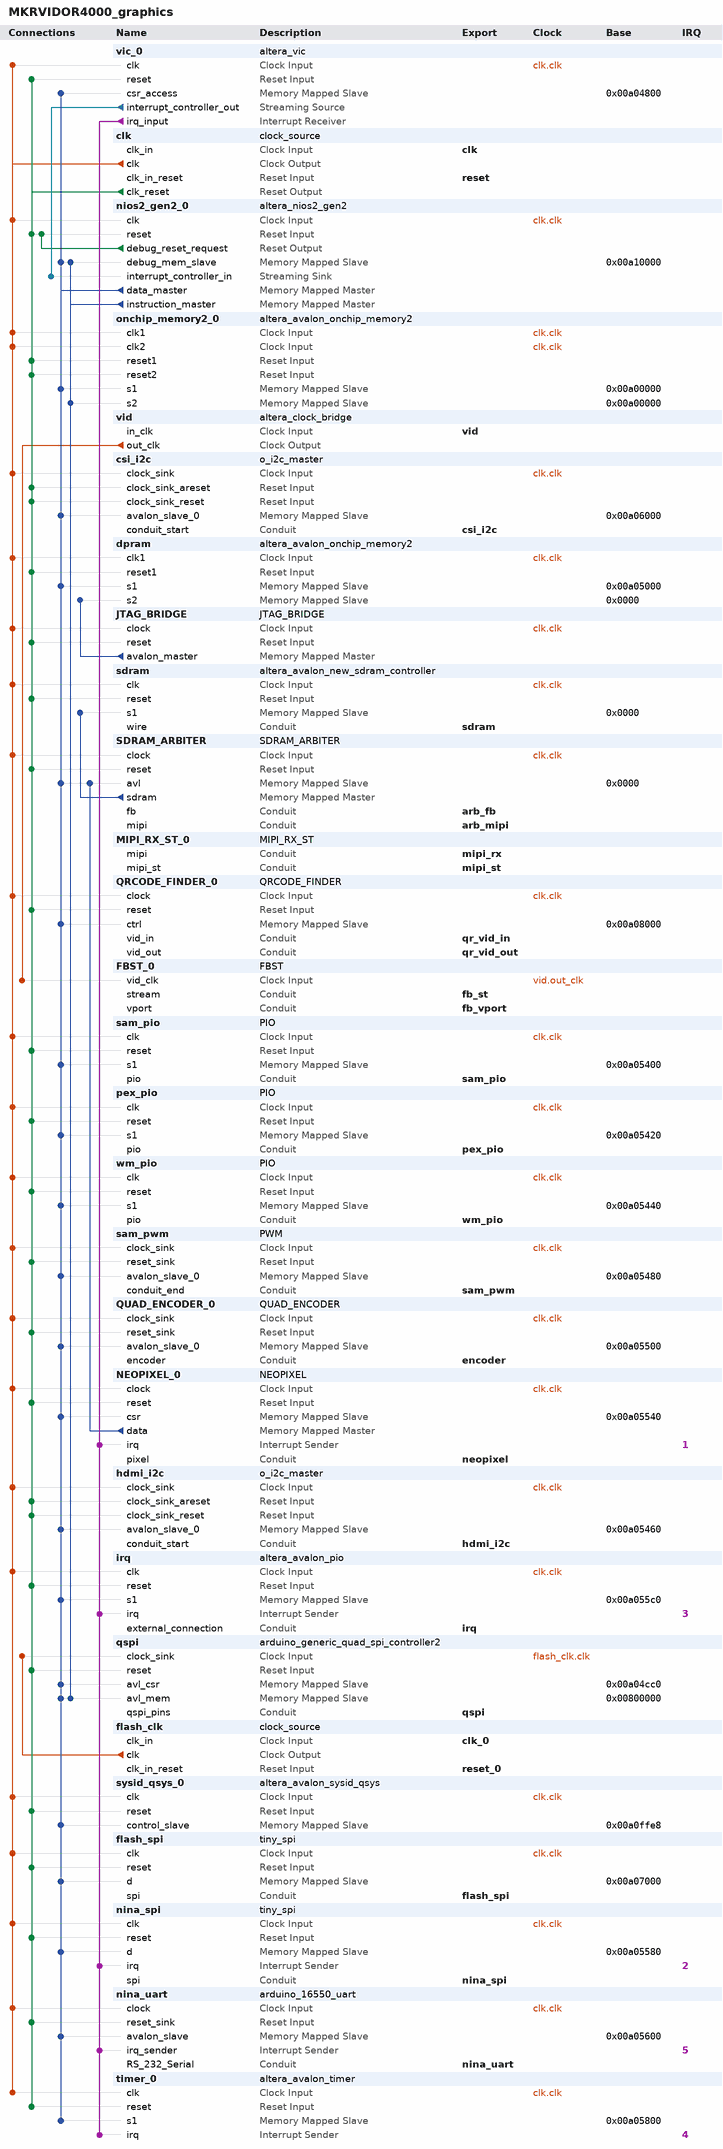
[diagram p0: system contents]
# Platform Designer (Qsys) system MKRVIDOR4000_graphics, Cyclone 10 LP 10CL016YU256C8G
# Parameters at their usual value, and those the tool derives, are not listed.
package require -exact qsys 18.0
create_system MKRVIDOR4000_graphics
set_project_property DEVICE_FAMILY {Cyclone 10 LP}
set_project_property DEVICE 10CL016YU256C8G

add_instance vic_0 altera_vic 18.0
set_instance_parameter_value vic_0 DAISY_CHAIN_ENABLE 0
set_instance_parameter_value vic_0 INTERRUPT_LATENCY_CYCLES 2
set_instance_parameter_value vic_0 NUMBER_OF_INT_PORTS 8
set_instance_parameter_value vic_0 OVERRIDE_INTERRUPT_LATENCY false
set_instance_parameter_value vic_0 RIL_WIDTH 4

add_instance clk clock_source 18.0
set_instance_parameter_value clk clockFrequency 100000000

add_instance nios2_gen2_0 altera_nios2_gen2 18.0
set_instance_parameter_value nios2_gen2_0 cpuID 531
set_instance_parameter_value nios2_gen2_0 dcache_size 2048
set_instance_parameter_value nios2_gen2_0 debug_hwbreakpoint 4
set_instance_parameter_value nios2_gen2_0 exceptionSlave onchip_memory2_0.s2
set_instance_parameter_value nios2_gen2_0 icache_size 8192
set_instance_parameter_value nios2_gen2_0 impl Fast
set_instance_parameter_value nios2_gen2_0 io_regionbase 10485760
set_instance_parameter_value nios2_gen2_0 resetSlave onchip_memory2_0.s2
set_instance_parameter_value nios2_gen2_0 setting_interruptControllerType External
set_instance_parameter_value nios2_gen2_0 setting_shadowRegisterSets 1

add_instance onchip_memory2_0 altera_avalon_onchip_memory2 18.0
set_instance_parameter_value onchip_memory2_0 dataWidth 32
set_instance_parameter_value onchip_memory2_0 dualPort true
set_instance_parameter_value onchip_memory2_0 initMemContent true
set_instance_parameter_value onchip_memory2_0 initializationFileName onchip_mem.hex
set_instance_parameter_value onchip_memory2_0 memorySize 16384

add_instance vid altera_clock_bridge 18.0
set_instance_parameter_value vid DERIVED_CLOCK_RATE 0
set_instance_parameter_value vid EXPLICIT_CLOCK_RATE 0

add_instance csi_i2c o_i2c_master 1.0

add_instance dpram altera_avalon_onchip_memory2 18.0
set_instance_parameter_value dpram dataWidth 32
set_instance_parameter_value dpram dualPort true
set_instance_parameter_value dpram initMemContent true
set_instance_parameter_value dpram initializationFileName onchip_mem.hex
set_instance_parameter_value dpram memorySize 1024
set_instance_parameter_value dpram singleClockOperation true

add_instance JTAG_BRIDGE JTAG_BRIDGE 1.0

add_instance sdram altera_avalon_new_sdram_controller 18.0
set_instance_parameter_value sdram TAC 5.4
set_instance_parameter_value sdram TRCD 20.0
set_instance_parameter_value sdram TRP 20.0
set_instance_parameter_value sdram casLatency 2
set_instance_parameter_value sdram columnWidth 8
set_instance_parameter_value sdram dataWidth 16
set_instance_parameter_value sdram generateSimulationModel false
set_instance_parameter_value sdram model single_Micron_MT48LC4M32B2_7_chip
set_instance_parameter_value sdram numberOfBanks 4
set_instance_parameter_value sdram numberOfChipSelects 1
set_instance_parameter_value sdram powerUpDelay 200.0
set_instance_parameter_value sdram refreshPeriod 31.25
set_instance_parameter_value sdram rowWidth 12

add_instance SDRAM_ARBITER SDRAM_ARBITER 1.0
set_instance_parameter_value SDRAM_ARBITER pADDRESS_BITS 22
set_instance_parameter_value SDRAM_ARBITER pBURST_SIZE 128
set_instance_parameter_value SDRAM_ARBITER pCAM_OFFSET_A 0
set_instance_parameter_value SDRAM_ARBITER pCAM_OFFSET_B 307200
set_instance_parameter_value SDRAM_ARBITER pFB_OFFSET 614400
set_instance_parameter_value SDRAM_ARBITER pFB_SIZE 307200

add_instance MIPI_RX_ST_0 MIPI_RX_ST 1.0

add_instance QRCODE_FINDER_0 QRCODE_FINDER 1.0
set_instance_parameter_value QRCODE_FINDER_0 pFIXED 5
set_instance_parameter_value QRCODE_FINDER_0 pHRES 640
set_instance_parameter_value QRCODE_FINDER_0 pTHRESHOLD 60
set_instance_parameter_value QRCODE_FINDER_0 pTHRESH_MIN 4
set_instance_parameter_value QRCODE_FINDER_0 pVRES 480

add_instance FBST_0 FBST 1.0
set_instance_parameter_value FBST_0 pHRES 640
set_instance_parameter_value FBST_0 pHSE 752
set_instance_parameter_value FBST_0 pHSS 656
set_instance_parameter_value FBST_0 pHTOTAL 762
set_instance_parameter_value FBST_0 pVRES 480
set_instance_parameter_value FBST_0 pVSE 492
set_instance_parameter_value FBST_0 pVSS 490
set_instance_parameter_value FBST_0 pVTOTAL 525

add_instance sam_pio PIO 1.0

add_instance pex_pio PIO 1.0

add_instance wm_pio PIO 1.0

add_instance sam_pwm PWM 1.0
set_instance_parameter_value sam_pwm pCHANNELS 23
set_instance_parameter_value sam_pwm pMATCH_BITS 16
set_instance_parameter_value sam_pwm pPRESCALER_BITS 32

add_instance QUAD_ENCODER_0 QUAD_ENCODER 1.0
set_instance_parameter_value QUAD_ENCODER_0 pENCODERS 11
set_instance_parameter_value QUAD_ENCODER_0 pENCODER_PRECISION 32

add_instance NEOPIXEL_0 NEOPIXEL 1.0
set_instance_parameter_value NEOPIXEL_0 pCHANNELS 11
set_instance_parameter_value NEOPIXEL_0 pSTART_ADDRESS 2097152

add_instance hdmi_i2c o_i2c_master 1.0

add_instance irq altera_avalon_pio 18.0
set_instance_parameter_value irq captureEdge true
set_instance_parameter_value irq direction InOut
set_instance_parameter_value irq generateIRQ true
set_instance_parameter_value irq irqType EDGE
set_instance_parameter_value irq width 2

add_instance qspi arduino_generic_quad_spi_controller2 18.0
set_instance_parameter_value qspi ATOM UNIDIRECTIONAL
set_instance_parameter_value qspi CHIP_SELS 1
set_instance_parameter_value qspi FLASH_TYPE N25Q16
set_instance_parameter_value qspi IO_MODE QUAD
set_instance_parameter_value qspi clkFreq 40000000

add_instance flash_clk clock_source 18.0
set_instance_parameter_value flash_clk clockFrequency 40000000

add_instance sysid_qsys_0 altera_avalon_sysid_qsys 18.0
set_instance_parameter_value sysid_qsys_0 id -1161707801

add_instance flash_spi tiny_spi 1.0
set_instance_parameter_value flash_spi BAUD_DIV 0
set_instance_parameter_value flash_spi BAUD_WIDTH 8
set_instance_parameter_value flash_spi SPI_MODE 0

add_instance nina_spi tiny_spi 1.0
set_instance_parameter_value nina_spi BAUD_DIV 0
set_instance_parameter_value nina_spi BAUD_WIDTH 8
set_instance_parameter_value nina_spi SPI_MODE 0

add_instance nina_uart arduino_16550_uart 18.0
set_instance_parameter_value nina_uart DMA_EXTRA 0
set_instance_parameter_value nina_uart FAMILY {Cyclone 10 LP}
set_instance_parameter_value nina_uart FIFO_DEPTH 128
set_instance_parameter_value nina_uart FIFO_HWFC 0
set_instance_parameter_value nina_uart FIFO_MODE 0
set_instance_parameter_value nina_uart FIFO_SWFC 0
set_instance_parameter_value nina_uart FIFO_WATERMARK 0
set_instance_parameter_value nina_uart MEM_BLOCK_TYPE AUTO

add_instance timer_0 altera_avalon_timer 18.0
set_instance_parameter_value timer_0 period 1
set_instance_parameter_value timer_0 periodUnits MSEC

# connections
add_connection clk.clk csi_i2c.clock_sink clock
add_connection clk.clk dpram.clk1 clock
add_connection clk.clk flash_spi.clk clock
add_connection clk.clk hdmi_i2c.clock_sink clock
add_connection clk.clk irq.clk clock
add_connection clk.clk JTAG_BRIDGE.clock clock
add_connection clk.clk NEOPIXEL_0.clock clock
add_connection clk.clk nina_spi.clk clock
add_connection clk.clk nina_uart.clock clock
add_connection clk.clk nios2_gen2_0.clk clock
add_connection clk.clk onchip_memory2_0.clk1 clock
add_connection clk.clk onchip_memory2_0.clk2 clock
add_connection clk.clk pex_pio.clk clock
add_connection clk.clk QRCODE_FINDER_0.clock clock
add_connection clk.clk QUAD_ENCODER_0.clock_sink clock
add_connection clk.clk sam_pio.clk clock
add_connection clk.clk sam_pwm.clock_sink clock
add_connection clk.clk sdram.clk clock
add_connection clk.clk SDRAM_ARBITER.clock clock
add_connection clk.clk sysid_qsys_0.clk clock
add_connection clk.clk timer_0.clk clock
add_connection clk.clk vic_0.clk clock
add_connection clk.clk wm_pio.clk clock
add_connection flash_clk.clk qspi.clock_sink clock
add_connection vid.out_clk FBST_0.vid_clk clock
add_connection clk.clk_reset csi_i2c.clock_sink_areset reset
add_connection clk.clk_reset csi_i2c.clock_sink_reset reset
add_connection clk.clk_reset dpram.reset1 reset
add_connection clk.clk_reset flash_spi.reset reset
add_connection clk.clk_reset hdmi_i2c.clock_sink_areset reset
add_connection clk.clk_reset hdmi_i2c.clock_sink_reset reset
add_connection clk.clk_reset irq.reset reset
add_connection clk.clk_reset JTAG_BRIDGE.reset reset
add_connection clk.clk_reset NEOPIXEL_0.reset reset
add_connection clk.clk_reset nina_spi.reset reset
add_connection clk.clk_reset nina_uart.reset_sink reset
add_connection clk.clk_reset nios2_gen2_0.reset reset
add_connection clk.clk_reset onchip_memory2_0.reset1 reset
add_connection clk.clk_reset onchip_memory2_0.reset2 reset
add_connection clk.clk_reset pex_pio.reset reset
add_connection clk.clk_reset QRCODE_FINDER_0.reset reset
add_connection clk.clk_reset qspi.reset reset
add_connection clk.clk_reset QUAD_ENCODER_0.reset_sink reset
add_connection clk.clk_reset sam_pio.reset reset
add_connection clk.clk_reset sam_pwm.reset_sink reset
add_connection clk.clk_reset sdram.reset reset
add_connection clk.clk_reset SDRAM_ARBITER.reset reset
add_connection clk.clk_reset sysid_qsys_0.reset reset
add_connection clk.clk_reset timer_0.reset reset
add_connection clk.clk_reset vic_0.reset reset
add_connection clk.clk_reset wm_pio.reset reset
add_connection nios2_gen2_0.debug_reset_request nios2_gen2_0.reset reset
add_connection JTAG_BRIDGE.avalon_master dpram.s2 avalon
set_connection_parameter_value JTAG_BRIDGE.avalon_master/dpram.s2 baseAddress 0x0000
add_connection NEOPIXEL_0.data SDRAM_ARBITER.avl avalon
set_connection_parameter_value NEOPIXEL_0.data/SDRAM_ARBITER.avl baseAddress 0x0000
add_connection nios2_gen2_0.data_master csi_i2c.avalon_slave_0 avalon
set_connection_parameter_value nios2_gen2_0.data_master/csi_i2c.avalon_slave_0 baseAddress 0x00a06000
add_connection nios2_gen2_0.data_master dpram.s1 avalon
set_connection_parameter_value nios2_gen2_0.data_master/dpram.s1 baseAddress 0x00a05000
add_connection nios2_gen2_0.data_master flash_spi.d avalon
set_connection_parameter_value nios2_gen2_0.data_master/flash_spi.d baseAddress 0x00a07000
add_connection nios2_gen2_0.data_master hdmi_i2c.avalon_slave_0 avalon
set_connection_parameter_value nios2_gen2_0.data_master/hdmi_i2c.avalon_slave_0 baseAddress 0x00a05460
add_connection nios2_gen2_0.data_master irq.s1 avalon
set_connection_parameter_value nios2_gen2_0.data_master/irq.s1 baseAddress 0x00a055c0
add_connection nios2_gen2_0.data_master NEOPIXEL_0.csr avalon
set_connection_parameter_value nios2_gen2_0.data_master/NEOPIXEL_0.csr baseAddress 0x00a05540
add_connection nios2_gen2_0.data_master nina_spi.d avalon
set_connection_parameter_value nios2_gen2_0.data_master/nina_spi.d baseAddress 0x00a05580
add_connection nios2_gen2_0.data_master nina_uart.avalon_slave avalon
set_connection_parameter_value nios2_gen2_0.data_master/nina_uart.avalon_slave baseAddress 0x00a05600
add_connection nios2_gen2_0.data_master nios2_gen2_0.debug_mem_slave avalon
set_connection_parameter_value nios2_gen2_0.data_master/nios2_gen2_0.debug_mem_slave baseAddress 0x00a10000
add_connection nios2_gen2_0.data_master onchip_memory2_0.s1 avalon
set_connection_parameter_value nios2_gen2_0.data_master/onchip_memory2_0.s1 baseAddress 0x00a00000
add_connection nios2_gen2_0.data_master pex_pio.s1 avalon
set_connection_parameter_value nios2_gen2_0.data_master/pex_pio.s1 baseAddress 0x00a05420
add_connection nios2_gen2_0.data_master QRCODE_FINDER_0.ctrl avalon
set_connection_parameter_value nios2_gen2_0.data_master/QRCODE_FINDER_0.ctrl baseAddress 0x00a08000
add_connection nios2_gen2_0.data_master qspi.avl_csr avalon
set_connection_parameter_value nios2_gen2_0.data_master/qspi.avl_csr baseAddress 0x00a04cc0
add_connection nios2_gen2_0.data_master qspi.avl_mem avalon
set_connection_parameter_value nios2_gen2_0.data_master/qspi.avl_mem baseAddress 0x00800000
add_connection nios2_gen2_0.data_master QUAD_ENCODER_0.avalon_slave_0 avalon
set_connection_parameter_value nios2_gen2_0.data_master/QUAD_ENCODER_0.avalon_slave_0 baseAddress 0x00a05500
add_connection nios2_gen2_0.data_master sam_pio.s1 avalon
set_connection_parameter_value nios2_gen2_0.data_master/sam_pio.s1 baseAddress 0x00a05400
add_connection nios2_gen2_0.data_master sam_pwm.avalon_slave_0 avalon
set_connection_parameter_value nios2_gen2_0.data_master/sam_pwm.avalon_slave_0 baseAddress 0x00a05480
add_connection nios2_gen2_0.data_master SDRAM_ARBITER.avl avalon
set_connection_parameter_value nios2_gen2_0.data_master/SDRAM_ARBITER.avl baseAddress 0x0000
add_connection nios2_gen2_0.data_master sysid_qsys_0.control_slave avalon
set_connection_parameter_value nios2_gen2_0.data_master/sysid_qsys_0.control_slave baseAddress 0x00a0ffe8
add_connection nios2_gen2_0.data_master timer_0.s1 avalon
set_connection_parameter_value nios2_gen2_0.data_master/timer_0.s1 baseAddress 0x00a05800
add_connection nios2_gen2_0.data_master vic_0.csr_access avalon
set_connection_parameter_value nios2_gen2_0.data_master/vic_0.csr_access baseAddress 0x00a04800
add_connection nios2_gen2_0.data_master wm_pio.s1 avalon
set_connection_parameter_value nios2_gen2_0.data_master/wm_pio.s1 baseAddress 0x00a05440
add_connection nios2_gen2_0.instruction_master nios2_gen2_0.debug_mem_slave avalon
set_connection_parameter_value nios2_gen2_0.instruction_master/nios2_gen2_0.debug_mem_slave baseAddress 0x00a10000
add_connection nios2_gen2_0.instruction_master onchip_memory2_0.s2 avalon
set_connection_parameter_value nios2_gen2_0.instruction_master/onchip_memory2_0.s2 baseAddress 0x00a00000
add_connection nios2_gen2_0.instruction_master qspi.avl_mem avalon
set_connection_parameter_value nios2_gen2_0.instruction_master/qspi.avl_mem baseAddress 0x00800000
add_connection SDRAM_ARBITER.sdram sdram.s1 avalon
set_connection_parameter_value SDRAM_ARBITER.sdram/sdram.s1 arbitrationPriority 8
set_connection_parameter_value SDRAM_ARBITER.sdram/sdram.s1 baseAddress 0x0000
add_connection vic_0.interrupt_controller_out nios2_gen2_0.interrupt_controller_in avalon_streaming
add_connection vic_0.irq_input irq.irq interrupt
set_connection_parameter_value vic_0.irq_input/irq.irq irqNumber 3
add_connection vic_0.irq_input NEOPIXEL_0.irq interrupt
set_connection_parameter_value vic_0.irq_input/NEOPIXEL_0.irq irqNumber 1
add_connection vic_0.irq_input nina_spi.irq interrupt
set_connection_parameter_value vic_0.irq_input/nina_spi.irq irqNumber 2
add_connection vic_0.irq_input nina_uart.irq_sender interrupt
set_connection_parameter_value vic_0.irq_input/nina_uart.irq_sender irqNumber 5
add_connection vic_0.irq_input timer_0.irq interrupt
set_connection_parameter_value vic_0.irq_input/timer_0.irq irqNumber 4

# exported interfaces
add_interface arb_fb conduit end
set_interface_property arb_fb EXPORT_OF SDRAM_ARBITER.fb
add_interface arb_mipi conduit end
set_interface_property arb_mipi EXPORT_OF SDRAM_ARBITER.mipi
add_interface clk clock sink
set_interface_property clk EXPORT_OF clk.clk_in
add_interface clk_0 clock sink
set_interface_property clk_0 EXPORT_OF flash_clk.clk_in
add_interface csi_i2c conduit end
set_interface_property csi_i2c EXPORT_OF csi_i2c.conduit_start
add_interface encoder conduit end
set_interface_property encoder EXPORT_OF QUAD_ENCODER_0.encoder
add_interface fb_st conduit end
set_interface_property fb_st EXPORT_OF FBST_0.stream
add_interface fb_vport conduit end
set_interface_property fb_vport EXPORT_OF FBST_0.vport
add_interface flash_spi conduit end
set_interface_property flash_spi EXPORT_OF flash_spi.spi
add_interface hdmi_i2c conduit end
set_interface_property hdmi_i2c EXPORT_OF hdmi_i2c.conduit_start
add_interface irq conduit end
set_interface_property irq EXPORT_OF irq.external_connection
add_interface mipi_rx conduit end
set_interface_property mipi_rx EXPORT_OF MIPI_RX_ST_0.mipi
add_interface mipi_st conduit end
set_interface_property mipi_st EXPORT_OF MIPI_RX_ST_0.mipi_st
add_interface neopixel conduit end
set_interface_property neopixel EXPORT_OF NEOPIXEL_0.pixel
add_interface nina_spi conduit end
set_interface_property nina_spi EXPORT_OF nina_spi.spi
add_interface nina_uart conduit end
set_interface_property nina_uart EXPORT_OF nina_uart.RS_232_Serial
add_interface pex_pio conduit end
set_interface_property pex_pio EXPORT_OF pex_pio.pio
add_interface qr_vid_in conduit end
set_interface_property qr_vid_in EXPORT_OF QRCODE_FINDER_0.vid_in
add_interface qr_vid_out conduit end
set_interface_property qr_vid_out EXPORT_OF QRCODE_FINDER_0.vid_out
add_interface qspi conduit end
set_interface_property qspi EXPORT_OF qspi.qspi_pins
add_interface reset reset sink
set_interface_property reset EXPORT_OF clk.clk_in_reset
add_interface reset_0 reset sink
set_interface_property reset_0 EXPORT_OF flash_clk.clk_in_reset
add_interface sam_pio conduit end
set_interface_property sam_pio EXPORT_OF sam_pio.pio
add_interface sam_pwm conduit end
set_interface_property sam_pwm EXPORT_OF sam_pwm.conduit_end
add_interface sdram conduit end
set_interface_property sdram EXPORT_OF sdram.wire
add_interface vid clock sink
set_interface_property vid EXPORT_OF vid.in_clk
add_interface wm_pio conduit end
set_interface_property wm_pio EXPORT_OF wm_pio.pio

set_interconnect_requirement {$system} qsys_mm.clockCrossingAdapter HANDSHAKE
set_interconnect_requirement {$system} qsys_mm.enableEccProtection FALSE
set_interconnect_requirement {$system} qsys_mm.insertDefaultSlave FALSE
set_interconnect_requirement {$system} qsys_mm.maxAdditionalLatency 1

save_system MKRVIDOR4000_graphics.qsys
